# Altium schematic sheet 02-CPU.schdoc
size B; SheetNumber: 0; SheetTotal: 0
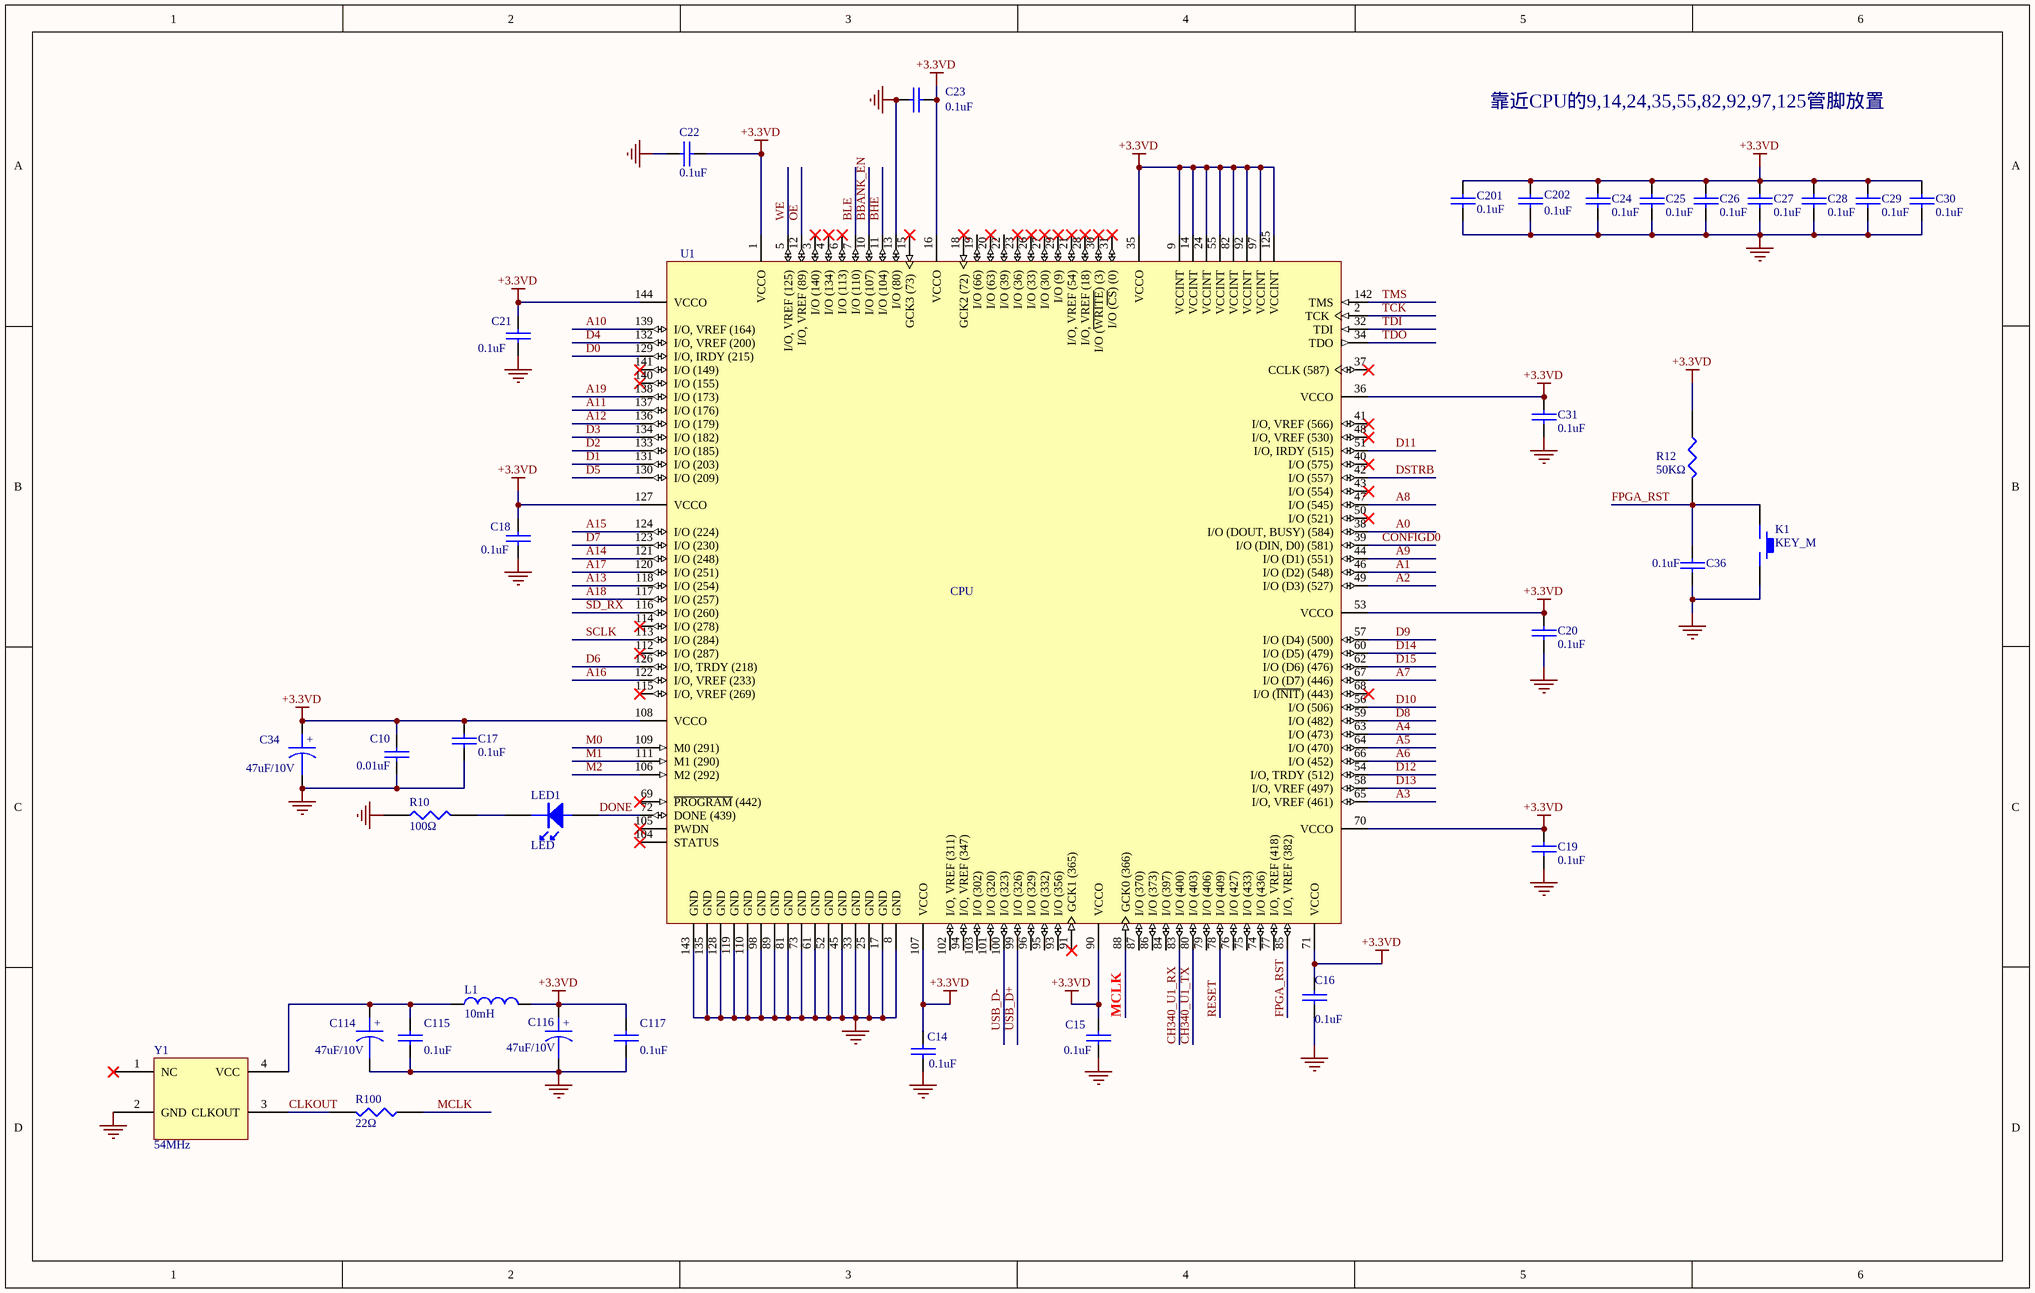
[diagram p0: 02-CPU.schdoc]

## Parts
C10  0.01uF  [0603]
C14  0.1uF  [0603]
C15  0.1uF  [0603]
C16  0.1uF  [0603]
C17  0.1uF  [0603]
C18  0.1uF  [0603]
C19  0.1uF  [0603]
C20  0.1uF  [0603]
C21  0.1uF  [0603]
C22  0.1uF  [0603]
C23  0.1uF  [0603]
C24  0.1uF  [0603]
C25  0.1uF  [0603]
C26  0.1uF  [0603]
C27  0.1uF  [0603]
C28  0.1uF  [0603]
C29  0.1uF  [0603]
C30  0.1uF  [0603]
C31  0.1uF  [0603]
C34  47uF/10V  [CAK45-E]
C36  0.1uF  [0603]
C114  47uF/10V  [CAK45-E]
C115  0.1uF  [0603]
C116  47uF/10V  [CAK45-E]
C117  0.1uF  [0603]
C201  0.1uF  [0603]
C202  0.1uF  [0603]
K1  KEY_M  [SWITCH]
L1  10mH  [L0805]
LED1  LED  [LED0805]
R10  100Ω  [0805]
R12  50KΩ  [0805]
R100  22Ω  [0805]
U1  CPU  [F-QFP20X20-G144/N]
Y1  54MHz  [7050晶振]

## Nets
+3.3VD: C10.1 C14.1 C15.2 C16.2 C17.1 C18.1 C19.2 C20.2 C21.2 C22.1 C23.1 C24.1 C25.1 C26.1 C27.1 C28.1 C29.1 C30.1 C31.2 C34.1 C116.1 C117.1 C201.1 C202.1 L1.2 R12.1 U1.1(VCCO) U1.9(VCCINT) U1.14(VCCINT) U1.16(VCCO) U1.24(VCCINT) U1.35(VCCO) U1.36(VCCO) U1.53(VCCO) U1.55(VCCINT) U1.70(VCCO) U1.71(VCCO) U1.82(VCCINT) U1.90(VCCO) U1.92(VCCINT) U1.97(VCCINT) U1.107(VCCO) U1.108(VCCO) U1.125(VCCINT) U1.127(VCCO) U1.144(VCCO)
DGND: C10.2 C14.2 C15.1 C16.1 C17.2 C18.2 C19.1 C20.1 C21.1 C22.2 C23.2 C24.2 C25.2 C26.2 C27.2 C28.2 C29.2 C30.2 C31.1 C34.2 C36.1 C114.2 C115.2 C116.2 C117.2 C201.2 C202.2 K1.2 R10.1 U1.8(GND) U1.13(I/O_(80)) U1.17(GND) U1.25(GND) U1.33(GND) U1.45(GND) U1.52(GND) U1.61(GND) U1.73(GND) U1.81(GND) U1.89(GND) U1.98(GND) U1.110(GND) U1.119(GND) U1.128(GND) U1.135(GND) U1.143(GND) Y1.2(GND)
A0: U1.38(I/O_(DOUT,_BUSY)_(584))
A1: U1.46(I/O_(D2)_(548))
A2: U1.49(I/O_(D3)_(527))
A3: U1.65(I/O,_VREF_(461))
A4: U1.63(I/O_(473))
A5: U1.64(I/O_(470))
A6: U1.66(I/O_(452))
A7: U1.67(I/O_(D7)_(446))
A8: U1.47(I/O_(545))
A9: U1.44(I/O_(D1)_(551))
A10: U1.139(I/O,_VREF_(164))
A11: U1.137(I/O_(176))
A12: U1.136(I/O_(179))
A13: U1.118(I/O_(254))
A14: U1.121(I/O_(248))
A15: U1.124(I/O_(224))
A16: U1.122(I/O,_VREF_(233))
A17: U1.120(I/O_(251))
A18: U1.117(I/O_(257))
A19: U1.138(I/O_(173))
BBANK_EN: U1.10(I/O_(107))
BHE: U1.11(I/O_(104))
BLE: U1.7(I/O_(110))
CH340_U1_RX: U1.83(I/O_(400))
CH340_U1_TX: U1.80(I/O_(403))
CLKOUT: R100.2 Y1.3(CLKOUT)
CONFIGD0: U1.39(I/O_(DIN,_D0)_(581))
D0: U1.129(I/O,_IRDY_(215))
D1: U1.131(I/O_(203))
D2: U1.133(I/O_(185))
D3: U1.134(I/O_(182))
D4: U1.132(I/O,_VREF_(200))
D5: U1.130(I/O_(209))
D6: U1.126(I/O,_TRDY_(218))
D7: U1.123(I/O_(230))
D8: U1.59(I/O_(482))
D9: U1.57(I/O_(D4)_(500))
D10: U1.56(I/O_(506))
D11: U1.51(I/O,_IRDY_(515))
D12: U1.54(I/O,_TRDY_(512))
D13: U1.58(I/O,_VREF_(497))
D14: U1.60(I/O_(D5)_(479))
D15: U1.62(I/O_(D6)_(476))
DONE: LED1.1(A) U1.72(DONE_(439))
DSTRB: U1.42(I/O_(557))
FPGA_RST: C36.2 K1.1 R12.2 U1.85(I/O,_VREF_(382))
M0: U1.109(M0_(291))
M1: U1.111(M1_(290))
M2: U1.106(M2_(292))
MCLK: R100.1 U1.88(GCK0_(366))
OE: U1.12(I/O,_VREF_(89))
RESET: U1.78(I/O_(409))
SCLK: U1.113(I/O_(284))
SD_RX: U1.116(I/O_(260))
TCK: U1.2(TCK)
TDI: U1.32(TDI)
TDO: U1.34(TDO)
TMS: U1.142(TMS)
USB_D+: U1.99(I/O_(326))
USB_D-: U1.100(I/O_(323))
WE: U1.5(I/O,_VREF_(125))
NetC114_1: C114.1 C115.1 L1.1 Y1.4(VCC)
NetLED1_2: LED1.2(K) R10.2

Not connected (* = marked no-connect by the designer): U1 3(I/O_(140))* 4(I/O_(134))* 6(I/O_(113))* 15(GCK3_(73))* 18(GCK2_(72))* 19(I/O_(66)) 20(I/O_(63))* 21(I/O,_VREF_(54))* 22(I/O_(39)) 23(I/O_(36))* 26(I/O_(33))* 27(I/O_(30))* 28(I/O,_VREF_(18))* 29(I/O_(9))* 30(I/O_(~{WRITE})_(3))* 31(I/O_(~{CS})_(0))* 37(CCLK_(587))* 40(I/O_(575))* 41(I/O,_VREF_(566))* 43(I/O_(554))* 48(I/O,_VREF_(530))* 50(I/O_(521))* 68(I/O_(~{INIT})_(443))* 69(~{PROGRAM}_(442))* 74(I/O_(436)) 75(I/O_(433)) 76(I/O_(427)) 77(I/O,_VREF_(418)) 79(I/O_(406)) 84(I/O_(397)) 86(I/O_(373)) 87(I/O_(370)) 91(GCK1_(365))* 93(I/O_(356)) 94(I/O,_VREF_(347)) 95(I/O_(332)) 96(I/O_(329)) 101(I/O_(320)) 102(I/O,_VREF_(311)) 103(I/O_(302)) 104(STATUS)* 105(PWDN)* 112(I/O_(287))* 114(I/O_(278))* 115(I/O,_VREF_(269))* 140(I/O_(155))* 141(I/O_(149))*; Y1 1(NC)*

## Notes on the sheet
- 靠近CPU的9,14,24,35,55,82,92,97,125管脚放置
- (in symbol CAPACITOR POL) +

## Library data of the parts
C10 C14-C31 C36 C115 C117 C201 C202 = CAP: Capacitor
C34 C114 C116 = CAPACITOR POL: Capacitor
L1 = Inductor: Code_IEC: 1005; Published: 8-Jun-2000; LatestRevisionDate: 29-May-2009; LatestRevisionNote: IPC-7351 Footprint Added.; PackageReference: 0402-A; Publisher: Altium Limited; PackageDescription: Chip Inductor; Code_JEITA: 0402
R10 R12 R100 = RES1
U1 = XC2S50-6TQ144C: Spartan-II 2.5V Field Programmable Gate Array; Text Field7: Published 13-Jul-2001
Y1 = OSC: active oscillation